# Altium project micromouse.PrjPcb
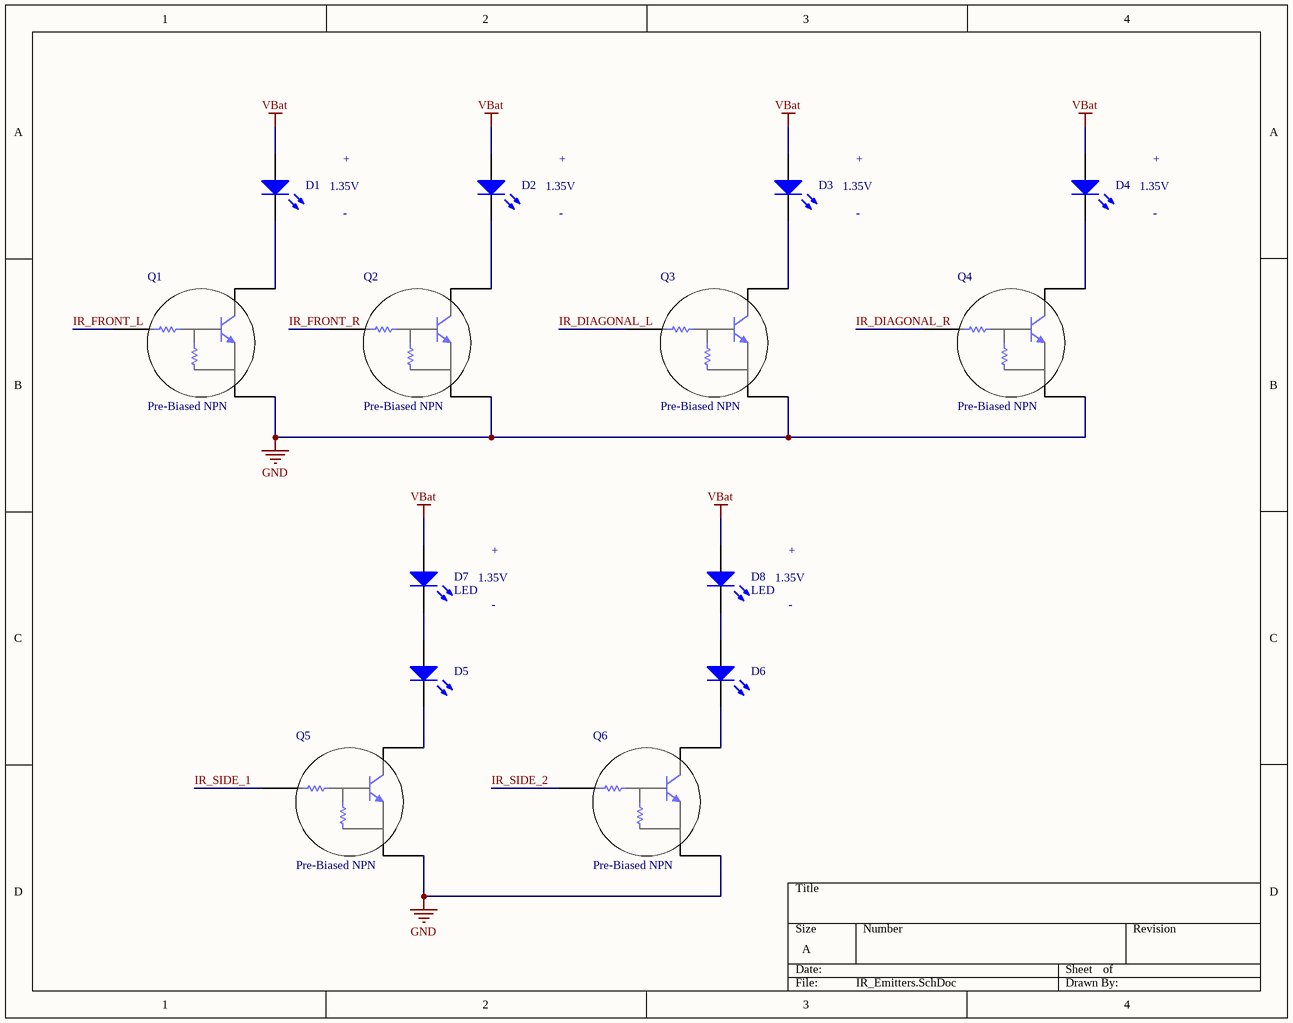
[diagram p0: IR_Emitters.SchDoc]
10 sheets, 109 parts. Net scope: global (net labels, ports and power ports of the same name join across sheets).
Board file: micromouse.PcbDoc
Sheets:
  IR_Emitters.SchDoc
  Gyroscope-Acceleromter.SchDoc
  Motor Control.SchDoc
  IR_Receivers.SchDoc
  Bluetooth.SchDoc
  Status_LED.SchDoc
  battery_charger.SchDoc
  Power_Regulation.SchDoc
  controller_power.SchDoc
  controller_peripherals.SchDoc

## Sheet IR_Emitters.SchDoc
size A

### Parts
D1  LED  [LED-Bent]  (value not drawn)
D2  LED  [LED-Bent]  (value not drawn)
D3  LED  [LED-Bent]  (value not drawn)
D4  LED  [LED-Bent]  (value not drawn)
D5  LED  [LED-Bent]  (value not drawn)
D6  LED  [LED-Bent]  (value not drawn)
D7  LED  [LED-Bent]
D8  LED  [LED-Bent]
Q1  Pre-Biased NPN  [SOT-416]
Q2  Pre-Biased NPN  [SOT-416]
Q3  Pre-Biased NPN  [SOT-416]
Q4  Pre-Biased NPN  [SOT-416]
Q5  Pre-Biased NPN  [SOT-416]
Q6  Pre-Biased NPN  [SOT-416]

### Nets
GND: Q1.2 Q2.2 Q3.2 Q4.2 Q5.2 Q6.2
VBat: D1.1(A) D2.1(A) D3.1(A) D4.1(A) D7.1(A) D8.1(A)
IR_DIAGONAL_L: Q3.1
IR_DIAGONAL_R: Q4.1
IR_FRONT_L: Q1.1
IR_FRONT_R: Q2.1
IR_SIDE_1: Q5.1
IR_SIDE_2: Q6.1
NetD1_2: D1.2(K) Q1.3
NetD2_2: D2.2(K) Q2.3
NetD3_2: D3.2(K) Q3.3
NetD4_2: D4.2(K) Q4.3
NetD5_1: D5.1(A) D7.2(K)
NetD5_2: D5.2(K) Q5.3
NetD6_1: D6.1(A) D8.2(K)
NetD6_2: D6.2(K) Q6.3

### Notes on the sheet
- +
- 1.35V
- -

### Library data of the parts
D1-D8 = LED: Vendor Part Number: 751-1203-ND; Manufacturer: Vishay; Manufacturer Part Number: TSAL6100; Vendor: Digikey; Published: 16-Mar-2013; LatestRevisionDate: 16-Mar-2013; LatestRevisionNote: Created; PackageReference: LED; Publisher: Anthony Merlino; PackageDescription: 5mm LED; 2 Leads
Q1-Q6 = Pre-Biased NPN: Manufacturer Part No: DTD743EETL; Vendor Part No: DTD743EETLTR-ND; Vendor: Digikey

## Sheet Gyroscope-Acceleromter.SchDoc
size A
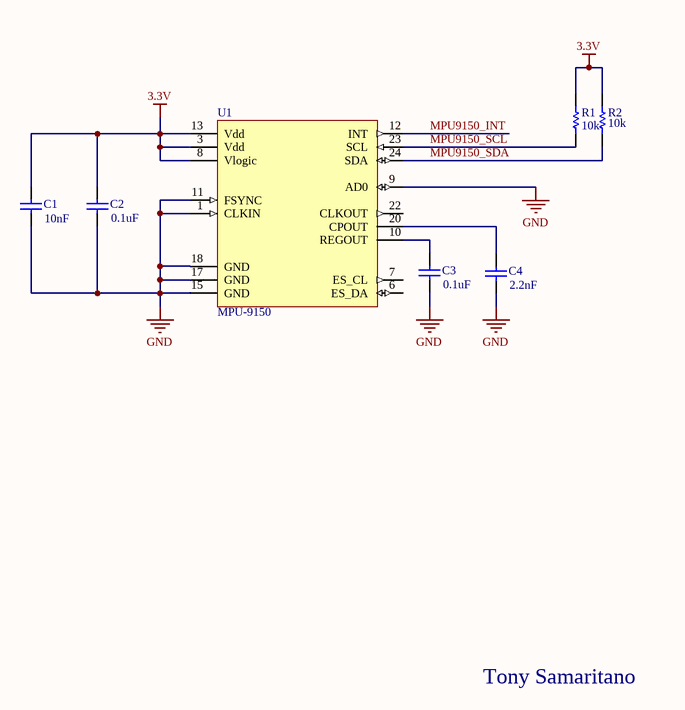
[diagram p1: Gyroscope-Acceleromter.SchDoc]

### Parts
C1  value 10nF  [1608[0603]]  (hidden comment: Cap Semi)
C2  value 0.1uF  [1608[0603]]  (hidden comment: Cap Semi)
C3  value 0.1uF  [1608[0603]]  (hidden comment: Cap Semi)
C4  value 2.2nF  [1608[0603]]  (hidden comment: Cap Semi)
R1  value 10k  [0603]  (hidden comment: Resistor)
R2  value 10k  [0603]  (hidden comment: Resistor)
U1  MPU-9150  [MPU-9150]

### Nets
3.3V: C1.2 C2.2 R1.2 R2.2 U1.3(Vdd) U1.8(Vlogic) U1.13(Vdd)
GND: C1.1 C2.1 C3.1 C4.1 U1.1(CLKIN) U1.9(AD0) U1.11(FSYNC) U1.15(GND) U1.17(GND) U1.18(GND)
MPU9150_INT: U1.12(INT)
MPU9150_SCL: R1.1 U1.23(SCL)
MPU9150_SDA: R2.1 U1.24(SDA)
NetC3_2: C3.2 U1.10(REGOUT)
NetC4_2: C4.2 U1.20(CPOUT)

Not connected (* = marked no-connect by the designer): U1 6(ES_DA) 7(ES_CL) 22(CLKOUT)

### Notes on the sheet
- Tony Samaritano

### Library data of the parts
C1-C4 = Cap Semi: Capacitor (Semiconductor SIM Model); Published: 8-Jun-2000; LatestRevisionDate: 29-May-2009; LatestRevisionNote: IPC-7351 Footprint Added.; PackageReference: C1206; Publisher: Altium Limited; PackageDescription: Chip Capacitor
R1 R2 = Resistor: Published: 8-Jun-2000; LatestRevisionDate: 17-Jul-2002; LatestRevisionNote: Re-released for DXP Platform.; PackageReference: AXIAL-0.3; Publisher: Altium Limited

## Sheet Motor Control.SchDoc
size A
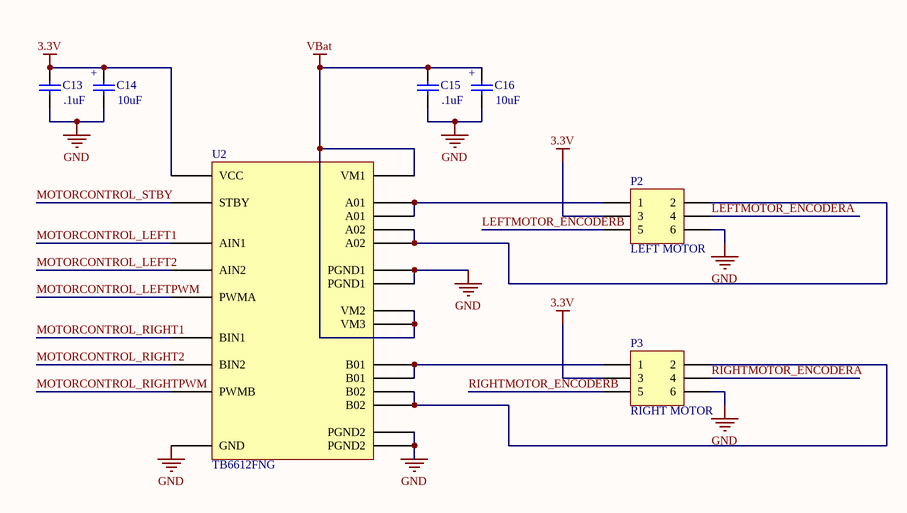
[diagram p2: Motor Control.SchDoc]

### Parts
C13  value .1uF  [1608[0603]]  (hidden comment: Cap Semi)
C14  value 10uF  [1608[0603]]  (hidden comment: Cap Semi)
C15  value .1uF  [1608[0603]]  (hidden comment: Cap Semi)
C16  value 10uF  [C1210]  (hidden comment: Cap Semi)
P2  LEFT MOTOR  [HDR2X3]
P3  RIGHT MOTOR  [HDR2X3]
U2  TB6612FNG  [SSOP24-P-300-0.65A]

### Nets
3.3V: C13.2 C14.2 P2.3 P3.3 U2.20(VCC)
GND: C13.1 C14.1 C15.1 C16.1 P2.6 P3.6 U2.3(PGND1) U2.4(PGND1) U2.9(PGND2) U2.10(PGND2) U2.18(GND)
VBat: C15.2 C16.2 U2.13(VM2) U2.14(VM3) U2.24(VM1)
LEFTMOTOR_ENCODERA: P2.4
LEFTMOTOR_ENCODERB: P2.5
MOTORCONTROL_LEFT1: U2.21(AIN1)
MOTORCONTROL_LEFT2: U2.22(AIN2)
MOTORCONTROL_LEFTPWM: U2.23(PWMA)
MOTORCONTROL_RIGHT1: U2.17(BIN1)
MOTORCONTROL_RIGHT2: U2.16(BIN2)
MOTORCONTROL_RIGHTPWM: U2.15(PWMB)
MOTORCONTROL_STBY: U2.19(STBY)
RIGHTMOTOR_ENCODERA: P3.4
RIGHTMOTOR_ENCODERB: P3.5
NetP2_1: P2.1 U2.1(A01) U2.2(A01)
NetP2_2: P2.2 U2.5(A02) U2.6(A02)
NetP3_1: P3.1 U2.11(B01) U2.12(B01)
NetP3_2: P3.2 U2.7(B02) U2.8(B02)

### Notes on the sheet
- (near C14) +
- (near C16) +

### Library data of the parts
C13-C16 = Cap Semi: Capacitor (Semiconductor SIM Model); Published: 8-Jun-2000; LatestRevisionDate: 29-May-2009; LatestRevisionNote: IPC-7351 Footprint Added.; PackageReference: C1206; Publisher: Altium Limited; PackageDescription: Chip Capacitor
P2 P3 = Header 3X2: Header, 3-Pin, Dual row; LatestRevisionDate: 17-Jul-2002; LatestRevisionNote: Re-released for DXP Platform.; Publisher: Altium Limited
U2 = TB6612FNG: Vendor Part No.: TB6612FNG(OC8EL)CT-ND; Manufacturer: Toshiba; Vendor: Digikey; Manufacturer Part No: TB6612FNG

## Sheet IR_Receivers.SchDoc
size A
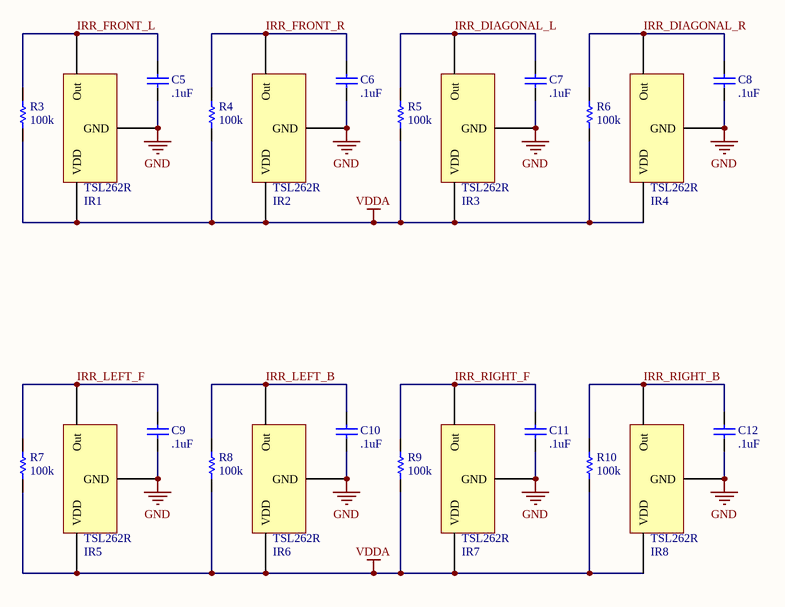
[diagram p3: IR_Receivers.SchDoc]

### Parts
C5  value .1uF  [1608[0603]]  (hidden comment: Cap Semi)
C6  value .1uF  [1608[0603]]  (hidden comment: Cap Semi)
C7  value .1uF  [1608[0603]]  (hidden comment: Cap Semi)
C8  value .1uF  [1608[0603]]  (hidden comment: Cap Semi)
C9  value .1uF  [1608[0603]]  (hidden comment: Cap Semi)
C10  value .1uF  [1608[0603]]  (hidden comment: Cap Semi)
C11  value .1uF  [1608[0603]]  (hidden comment: Cap Semi)
C12  value .1uF  [1608[0603]]  (hidden comment: Cap Semi)
IR1  TSL262R  [TSL262R]
IR2  TSL262R  [TSL262R]
IR3  TSL262R  [TSL262R]
IR4  TSL262R  [TSL262R]
IR5  TSL262R  [TSL262R]
IR6  TSL262R  [TSL262R]
IR7  TSL262R  [TSL262R]
IR8  TSL262R  [TSL262R]
R3  value 100k  [0603]  (hidden comment: Resistor)
R4  value 100k  [0603]  (hidden comment: Resistor)
R5  value 100k  [0603]  (hidden comment: Resistor)
R6  value 100k  [0603]  (hidden comment: Resistor)
R7  value 100k  [0603]  (hidden comment: Resistor)
R8  value 100k  [0603]  (hidden comment: Resistor)
R9  value 100k  [0603]  (hidden comment: Resistor)
R10  value 100k  [0603]  (hidden comment: Resistor)

### Nets
GND: C5.1 C6.1 C7.1 C8.1 C9.1 C10.1 C11.1 C12.1 IR1.0(GND) IR2.0(GND) IR3.0(GND) IR4.0(GND) IR5.0(GND) IR6.0(GND) IR7.0(GND) IR8.0(GND)
VDDA: IR1.1(VDD) IR2.1(VDD) IR3.1(VDD) IR4.1(VDD) IR5.1(VDD) IR6.1(VDD) IR7.1(VDD) IR8.1(VDD) R3.1 R4.1 R5.1 R6.1 R7.1 R8.1 R9.1 R10.1  [project net 3.3V]
IRR_DIAGONAL_L: C7.2 IR3.2(Out) R5.2
IRR_DIAGONAL_R: C8.2 IR4.2(Out) R6.2
IRR_FRONT_L: C5.2 IR1.2(Out) R3.2
IRR_FRONT_R: C6.2 IR2.2(Out) R4.2
IRR_LEFT_B: C10.2 IR6.2(Out) R8.2
IRR_LEFT_F: C9.2 IR5.2(Out) R7.2
IRR_RIGHT_B: C12.2 IR8.2(Out) R10.2
IRR_RIGHT_F: C11.2 IR7.2(Out) R9.2

### Library data of the parts
C5-C12 = Cap Semi: Capacitor (Semiconductor SIM Model); Published: 8-Jun-2000; LatestRevisionDate: 29-May-2009; LatestRevisionNote: IPC-7351 Footprint Added.; PackageReference: C1206; Publisher: Altium Limited; PackageDescription: Chip Capacitor
R3-R10 = Resistor: Published: 8-Jun-2000; LatestRevisionDate: 17-Jul-2002; LatestRevisionNote: Re-released for DXP Platform.; PackageReference: AXIAL-0.3; Publisher: Altium Limited

## Sheet Bluetooth.SchDoc
size A
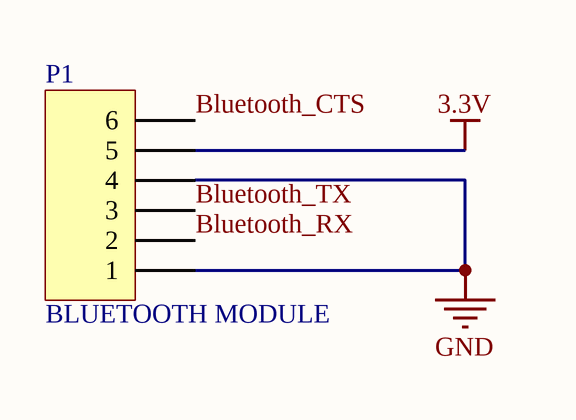
[diagram p4: Bluetooth.SchDoc]

### Parts
P1  BLUETOOTH MODULE  [HDR1X6]

### Nets
3.3V: P1.5
GND: P1.1 P1.4
Bluetooth_CTS: P1.6
Bluetooth_RX: P1.2
Bluetooth_TX: P1.3

### Library data of the parts
P1 = Header 6: Header, 6-Pin; LatestRevisionDate: 17-Jul-2002; LatestRevisionNote: Re-released for DXP Platform.; Publisher: Altium Limited

## Sheet Status_LED.SchDoc
size A
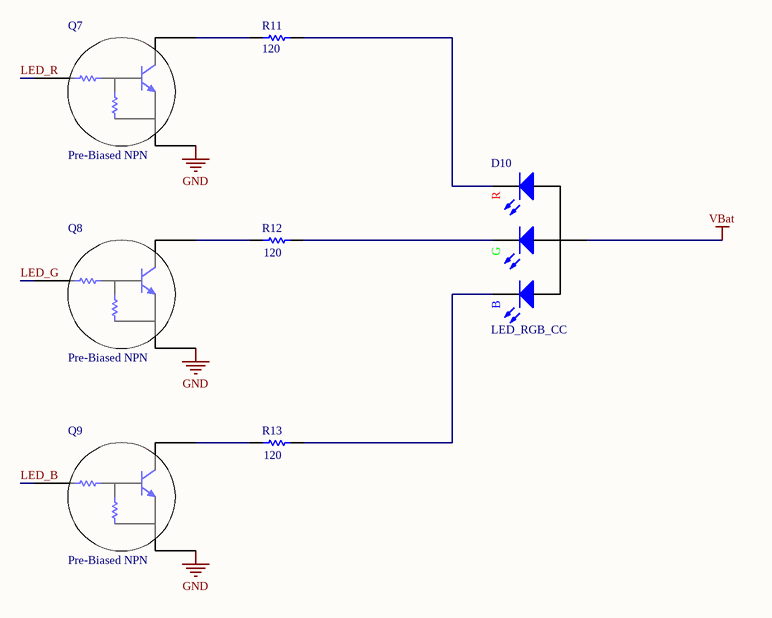
[diagram p5: Status_LED.SchDoc]

### Parts
D10  LED_RGB_CC  [SM1210RGB]
Q7  Pre-Biased NPN  [SOT-416]
Q8  Pre-Biased NPN  [SOT-416]
Q9  Pre-Biased NPN  [SOT-416]
R11  value 120  [0603]  (hidden comment: Resistor)
R12  value 120  [0603]  (hidden comment: Resistor)
R13  value 120  [0603]  (hidden comment: Resistor)

### Nets
GND: Q7.2 Q8.2 Q9.2
VBat: D10.1
LED_B: Q9.1
LED_G: Q8.1
LED_R: Q7.1
NetD10_2: D10.2 R11.2
NetD10_3: D10.3 R12.2
NetD10_4: D10.4 R13.2
NetQ7_3: Q7.3 R11.1
NetQ8_3: Q8.3 R12.1
NetQ9_3: Q9.3 R13.1

### Notes on the sheet
- (in symbol LED_RGB_CC) R; G; B

### Library data of the parts
D10 = LED_RGB_CC: RGB LED Common Cathode
Q7-Q9 = Pre-Biased NPN: as Q1 on sheet IR_Emitters
R11-R13 = Resistor: Published: 8-Jun-2000; LatestRevisionDate: 17-Jul-2002; LatestRevisionNote: Re-released for DXP Platform.; PackageReference: AXIAL-0.3; Publisher: Altium Limited

## Sheet battery_charger.SchDoc
size A
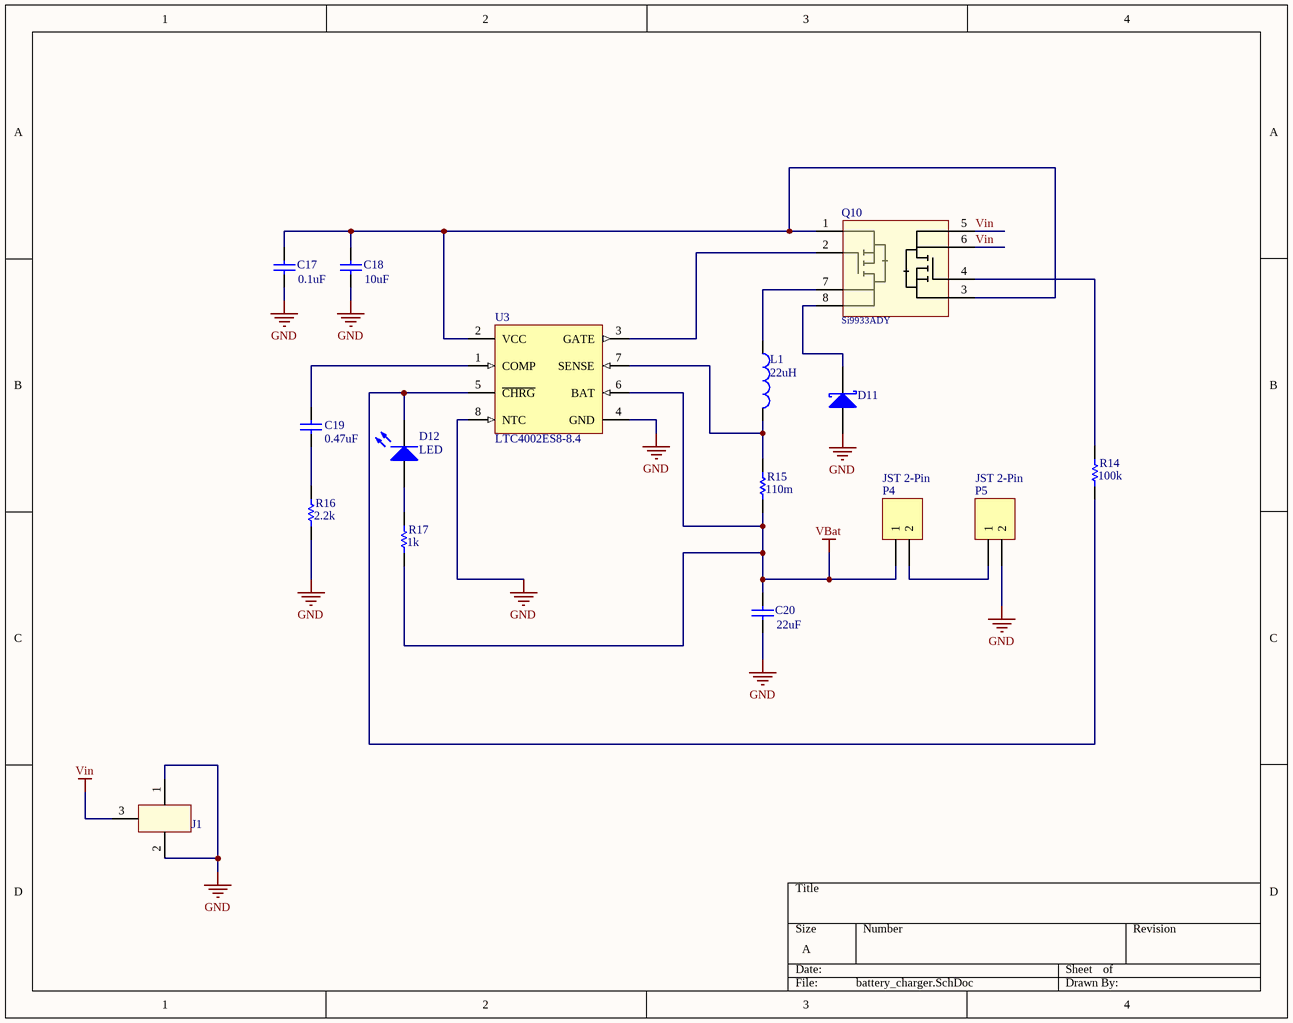
[diagram p6: battery_charger.SchDoc]

### Parts
C17  value 0.1uF  [1608[0603]]  (hidden comment: Cap Semi)
C18  value 10uF  [C1210]  (hidden comment: Cap Semi)
C19  value 0.47uF  [1608[0603]]  (hidden comment: Cap Semi)
C20  value 22uF  [C1210]  (hidden comment: Cap Semi)
D11  D Schottky  [SMB]  (value not drawn)
D12  LED  [0603]
J1  DC Barrel Jack  [DC Barrel Jack]  (value not drawn)
L1  value 22uH  [INDC6060X49N]  (hidden comment: Inductor)
P4  JST 2-Pin  [JST Connector 2-pin]
P5  JST 2-Pin  [JST Connector 2-pin]
Q10  Dual P-Channel  [SOIC-8]  (value not drawn)
R14  value 100k  [0603]  (hidden comment: Resistor)
R15  value 110m  [0603]  (hidden comment: Resistor)
R16  value 2.2k  [0603]  (hidden comment: Resistor)
R17  value 1k  [0603]  (hidden comment: Resistor)
U3  LTC4002ES8-8.4  [LT-S8-8_N]

### Nets
GND: C17.1 C18.1 C20.1 D11.1(A) J1.1(Casing) J1.2(Casing) P5.2 R16.1 U3.4(GND) U3.8(NTC)
VBat: C20.2 P4.1 R15.1 R17.1 U3.6(BAT)
Vin: J1.3(Center) Q10.5(D2) Q10.6(D2)
NetC17_2: C17.2 C18.2 Q10.1(S1) Q10.3(S2) U3.2(VCC)
NetC19_1: C19.1 R16.2
NetC19_2: C19.2 U3.1(COMP)
NetD11_2: D11.2(K) Q10.8(D1)
NetD12_1: D12.1(A) R17.2
NetD12_2: D12.2(K) R14.1 U3.5(~{CHRG})
NetL1_1: L1.1 Q10.7(D1)
NetL1_2: L1.2 R15.2 U3.7(SENSE)
NetP4_2: P4.2 P5.1
NetQ10_2: Q10.2(G1) U3.3(GATE)
NetQ10_4: Q10.4(G2) R14.2

### Library data of the parts
C17-C20 = Cap Semi: Capacitor (Semiconductor SIM Model); Published: 8-Jun-2000; LatestRevisionDate: 29-May-2009; LatestRevisionNote: IPC-7351 Footprint Added.; PackageReference: C1206; Publisher: Altium Limited; PackageDescription: Chip Capacitor
D11 = D Schottky: Schottky Diode; Published: 8-Jun-2000; LatestRevisionDate: 17-Jul-2002; LatestRevisionNote: Re-released for DXP Platform.; PackageReference: SMB; Publisher: Altium Limited; PackageDescription: DO-214-AA/SMB; 2 C-Bend Leads; Body 5.3 x 3.6 mm, inc. leads (LxW); Code_JEDEC: DO-214-AA
D12 = LED: as D1 on sheet IR_Emitters; Published: 16-Mar-2013; LatestRevisionDate: 16-Mar-2013; LatestRevisionNote: Created; PackageReference: LED; Publisher: Anthony Merlino; PackageDescription: 5mm LED; 2 Leads
J1 = DC Barrel Jack: DC Barrel Jack, Fits 5mm DC Wall Adapter
L1 = Inductor: Code_IEC: 1005; Published: 8-Jun-2000; LatestRevisionDate: 29-May-2009; LatestRevisionNote: IPC-7351 Footprint Added.; PackageReference: 0402-A; Publisher: Altium Limited; PackageDescription: Chip Inductor; Code_JEITA: 0402
P4 P5 = JST Connector 2-Pin: Header, 2-Pin; LatestRevisionDate: 17-Jul-2002; LatestRevisionNote: Re-released for DXP Platform.; Publisher: Altium Limited
Q10 = Si9933ADY: Dual P-Channel 20-V (D-S) MOSFET; Manufacturer Part N.O.: Si9933ADY
U3 = LTC4002ES8-8.4: Standalone Li-Ion Switch Mode Battery Charger, 8.9 to 22 V Vin, 8-pin SOIC (S8-8), -40 to 85 degC; Manufacturer: Linear Technology; Battery Chemistry: Li-Ion, Li-Polymer; Charge Termination: On-board timer; Float Voltage: 8.4 V; Number of Cells: 2; Type of Charger: Switching; Vin Max(V): 22; Vin Min(V): 8.9; PackageVersion: Rev. G, 03/2012; PackageReference: S8-8; PackageDescription: 8-Pin Plastic Small Outline (Narrow .150 Inch), Body 4.9 x 3.9 mm, Pitch 1.27 mm; Supplier 1: Digi-Key; Supplier Part Number 1: LTC4002ES8-8.4-ND; RoHS: FALSE; Mounting Technology: Surface Mount; PartNumber: LTC4002ES8-8.4; ComponentLink1Description: Manufacturer URL; ComponentLink1URL: http://www.linear.com/; ComponentLink2Description: Datasheet; ComponentLink2URL: http://cds.linear.com/docs/en/datasheet/4002f.pdf; ComponentLink3Description: Package Specification; ComponentLink3URL: http://cds.linear.com/docs/en/packaging/05081610_G_SO8.pdf
R14-R17 = Resistor: Published: 8-Jun-2000; LatestRevisionDate: 17-Jul-2002; LatestRevisionNote: Re-released for DXP Platform.; PackageReference: AXIAL-0.3; Publisher: Altium Limited

## Sheet Power_Regulation.SchDoc
size A
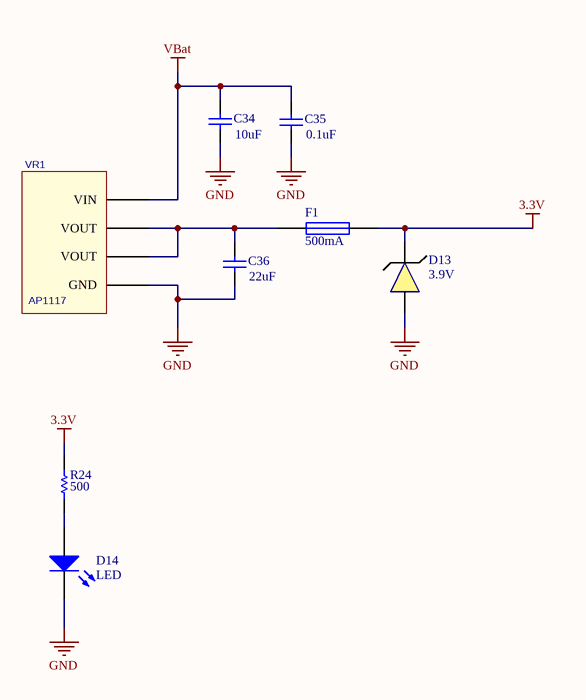
[diagram p7: Power_Regulation.SchDoc]

### Parts
C34  value 10uF  [1608[0603]]  (hidden comment: Cap Semi)
C35  value 0.1uF  [1608[0603]]  (hidden comment: Cap Semi)
C36  value 22uF  [1608[0603]]  (hidden comment: Cap Semi)
D13  3.9V  [DO-214AC]
D14  LED  [0603]
F1  500mA  [0603 PTC Fuse]
R24  value 500  [0603]  (hidden comment: Resistor)
VR1  AP1117  [SOT-223]

### Nets
3.3V: D13.1 F1.2 R24.2
GND: C34.1 C35.1 C36.1 D13.2 D14.2(K) VR1.1(GND)
VBat: C34.2 C35.2 VR1.3(VIN)
NetC36_2: C36.2 F1.1 VR1.2(VOUT) VR1.4(VOUT)
NetD14_1: D14.1(A) R24.1

### Library data of the parts
C34-C36 = Cap Semi: Capacitor (Semiconductor SIM Model); Published: 8-Jun-2000; LatestRevisionDate: 29-May-2009; LatestRevisionNote: IPC-7351 Footprint Added.; PackageReference: C1206; Publisher: Altium Limited; PackageDescription: Chip Capacitor
D13 = Zener Diode: 3.9V 1.25W
D14 = LED: as D1 on sheet IR_Emitters; Published: 16-Mar-2013; LatestRevisionDate: 16-Mar-2013; LatestRevisionNote: Created; PackageReference: LED; Publisher: Anthony Merlino; PackageDescription: 5mm LED; 2 Leads
F1 = Fuse: Published: 8-Jun-2000; LatestRevisionDate: 17-Jul-2002; LatestRevisionNote: Re-released for DXP Platform.; PackageReference: PIN-W2/E2.8; Publisher: Altium Limited; PackageDescription: Thru-Hole; 2 Leads
R24 = Resistor: Published: 8-Jun-2000; LatestRevisionDate: 17-Jul-2002; LatestRevisionNote: Re-released for DXP Platform.; PackageReference: AXIAL-0.3; Publisher: Altium Limited
VR1 = AP1117: Value: *

## Sheet controller_power.SchDoc
size A
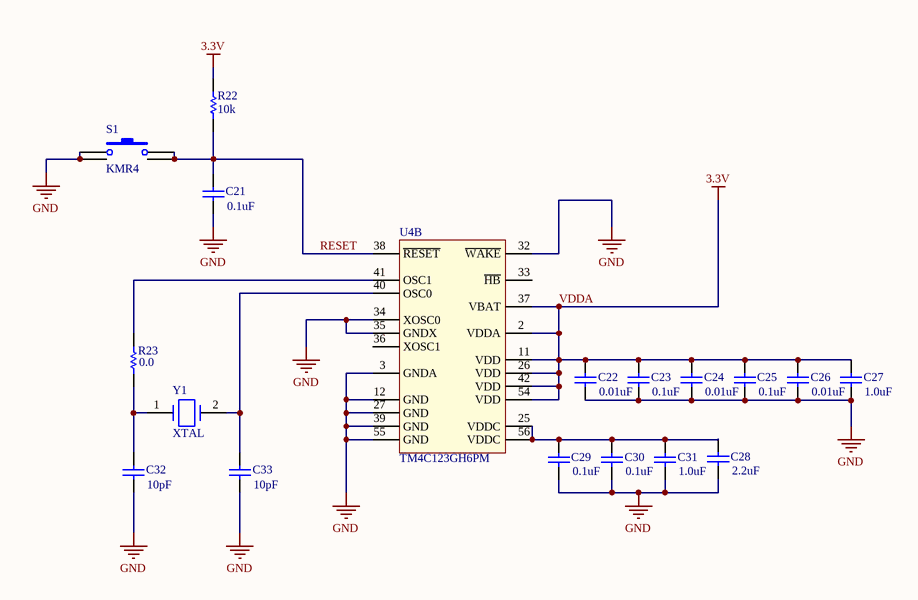
[diagram p8: controller_power.SchDoc]

### Parts
C21  value 0.1uF  [1608[0603]]  (hidden comment: Cap Semi)
C22  value 0.01uF  [1608[0603]]  (hidden comment: Cap Semi)
C23  value 0.1uF  [1608[0603]]  (hidden comment: Cap Semi)
C24  value 0.01uF  [1608[0603]]  (hidden comment: Cap Semi)
C25  value 0.1uF  [1608[0603]]  (hidden comment: Cap Semi)
C26  value 0.01uF  [1608[0603]]  (hidden comment: Cap Semi)
C27  value 1.0uF  [1608[0603]]  (hidden comment: Cap Semi)
C28  value 2.2uF  [1608[0603]]  (hidden comment: Cap Semi)
C29  value 0.1uF  [1608[0603]]  (hidden comment: Cap Semi)
C30  value 0.1uF  [1608[0603]]  (hidden comment: Cap Semi)
C31  value 1.0uF  [1608[0603]]  (hidden comment: Cap Semi)
C32  value 10pF  [1608[0603]]  (hidden comment: Cap Semi)
C33  value 10pF  [1608[0603]]  (hidden comment: Cap Semi)
R22  value 10k  [0603]  (hidden comment: Resistor)
R23  value 0.0  [0603]  (hidden comment: Resistor)
S1  KMR4  [KMR4]
U4  TM4C123GH6PM  [TSQFP50P1200X1200X145-64N]  (part B of 2)
Y1  XTAL  [ABM3_SERIES]

### Nets
3.3V: C22.2 C23.2 C24.2 C25.2 C26.2 C27.2 R22.2 U4.2(VDDA) U4.11(VDD) U4.26(VDD) U4.37(VBAT) U4.42(VDD) U4.54(VDD)  [also labelled VDDA]
GND: C21.1 C22.1 C23.1 C24.1 C25.1 C26.1 C27.1 C28.1 C29.1 C30.1 C31.1 C32.1 C33.1 S1.1 S1.3 U4.3(GNDA) U4.12(GND) U4.27(GND) U4.32(~{WAKE}) U4.34(XOSC0) U4.35(GNDX) U4.39(GND) U4.55(GND)
RESET: C21.2 R22.1 S1.2 S1.4 U4.38(~{RESET})
NetC28_2: C28.2 C29.2 C30.2 C31.2 U4.25(VDDC) U4.56(VDDC)
NetC32_2: C32.2 R23.1 Y1.1(OSC1)
NetC33_2: C33.2 U4.40(OSC0) Y1.2(OSC2)
NetR23_2: R23.2 U4.41(OSC1)

Not connected (* = marked no-connect by the designer): U4 33(~{HB}) 36(XOSC1)

### Library data of the parts
C21-C33 = Cap Semi: Capacitor (Semiconductor SIM Model); Published: 8-Jun-2000; LatestRevisionDate: 29-May-2009; LatestRevisionNote: IPC-7351 Footprint Added.; PackageReference: C1206; Publisher: Altium Limited; PackageDescription: Chip Capacitor
S1 = SPST Tactile Switch: Switch; Published: 24-Mar-1999; LatestRevisionDate: 17-Jul-2002; LatestRevisionNote: Re-released for DXP Platform.; PackageReference: SPST-2; Publisher: Altium Limited
U4 = TM4C123GH6PM: Tiva C TM4C123GH6PM
Y1 = XTAL: Crystal Oscillator; Published: 8-Jun-2000; LatestRevisionDate: 17-Jul-2002; LatestRevisionNote: Re-released for DXP Platform.; PackageReference: R38; Publisher: Altium Limited; PackageDescription: Crystal, Thru-Hole; 2 Leads; Body 3.1 x 8.2 mm (Dia.xH)
R22 R23 = Resistor: Published: 8-Jun-2000; LatestRevisionDate: 17-Jul-2002; LatestRevisionNote: Re-released for DXP Platform.; PackageReference: AXIAL-0.3; Publisher: Altium Limited

## Sheet controller_peripherals.SchDoc
size A
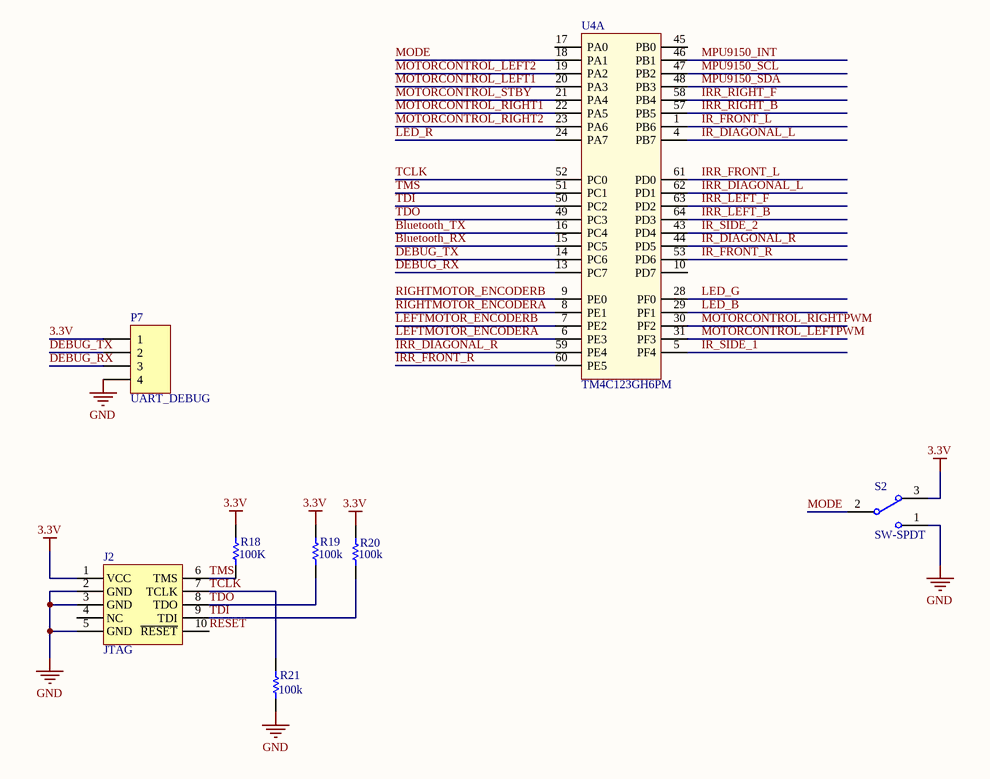
[diagram p9: controller_peripherals.SchDoc]

### Parts
J2  JTAG  [HDR2X5]
P7  UART_DEBUG  [HDR1X4]
R18  value 100K  [0603]  (hidden comment: Resistor)
R19  value 100k  [0603]  (hidden comment: Resistor)
R20  value 100k  [0603]  (hidden comment: Resistor)
R21  value 100k  [0603]  (hidden comment: Resistor)
S2  SW-SPDT  [SPDT Switch]
U4  TM4C123GH6PM  [TSQFP50P1200X1200X145-64N]  (part A of 2)

### Nets
3.3V: J2.1(VCC) P7.1 R18.2 R19.2 R20.2 S2.3
GND: J2.2(GND) J2.3(GND) J2.5(GND) P7.4 R21.1 S2.1
Bluetooth_RX: U4.15(PC5)
Bluetooth_TX: U4.16(PC4)
DEBUG_RX: P7.3 U4.13(PC7)
DEBUG_TX: P7.2 U4.14(PC6)
IR_DIAGONAL_L: U4.4(PB7)
IR_DIAGONAL_R: U4.44(PD5)
IR_FRONT_L: U4.1(PB6)
IR_FRONT_R: U4.53(PD6)
IR_SIDE_1: U4.5(PF4)
IR_SIDE_2: U4.43(PD4)
IRR_DIAGONAL_L: U4.62(PD1)
IRR_DIAGONAL_R: U4.59(PE4)
IRR_FRONT_L: U4.61(PD0)
IRR_FRONT_R: U4.60(PE5)
IRR_LEFT_B: U4.64(PD3)
IRR_LEFT_F: U4.63(PD2)
IRR_RIGHT_B: U4.57(PB5)
IRR_RIGHT_F: U4.58(PB4)
LED_B: U4.29(PF1)
LED_G: U4.28(PF0)
LED_R: U4.24(PA7)
LEFTMOTOR_ENCODERA: U4.6(PE3)
LEFTMOTOR_ENCODERB: U4.7(PE2)
MODE: S2.2 U4.18(PA1)
MOTORCONTROL_LEFT1: U4.20(PA3)
MOTORCONTROL_LEFT2: U4.19(PA2)
MOTORCONTROL_LEFTPWM: U4.31(PF3)
MOTORCONTROL_RIGHT1: U4.22(PA5)
MOTORCONTROL_RIGHT2: U4.23(PA6)
MOTORCONTROL_RIGHTPWM: U4.30(PF2)
MOTORCONTROL_STBY: U4.21(PA4)
MPU9150_INT: U4.46(PB1)
MPU9150_SCL: U4.47(PB2)
MPU9150_SDA: U4.48(PB3)
RESET: J2.10(~{RESET})
RIGHTMOTOR_ENCODERA: U4.8(PE1)
RIGHTMOTOR_ENCODERB: U4.9(PE0)
TCLK: J2.7(TCLK) R21.2 U4.52(PC0)
TDI: J2.9(TDI) R20.1 U4.50(PC2)
TDO: J2.8(TDO) R19.1 U4.49(PC3)
TMS: J2.6(TMS) R18.1 U4.51(PC1)

Not connected (* = marked no-connect by the designer): J2 4(NC); U4 10(PD7) 17(PA0) 45(PB0)

### Library data of the parts
J2 = 10-Pin JTAG ARM: 10-Pin JTAG Connector for Cortex M4 etc.
P7 = Header 4: Header, 4-Pin; LatestRevisionDate: 17-Jul-2002; LatestRevisionNote: Re-released for DXP Platform.; Publisher: Altium Limited
S2 = SW-SPDT: SPDT Subminiature Toggle Switch, Right Angle Mounting, Vertical Actuation; Published: 24-Mar-1999; LatestRevisionDate: 17-Dec-2003; LatestRevisionNote: Schematic revised, PCB Footprint replaced.; DatasheetVersion: 05-Dec-2000; PackageReference: TL36WW15050; Publisher: Altium Limited; PackageDescription: Switch; 4 Leads; ComponentLink1Description: Manufacturer Link; ComponentLink1URL: http://www.apem.com
U4 = TM4C123GH6PM: Tiva C TM4C123GH6PM
R18-R21 = Resistor: Published: 8-Jun-2000; LatestRevisionDate: 17-Jul-2002; LatestRevisionNote: Re-released for DXP Platform.; PackageReference: AXIAL-0.3; Publisher: Altium Limited

## Nets that join several sheets
3.3V: Gyroscope-Acceleromter (7 pins), Motor Control (5 pins), IR_Receivers (16 pins), Bluetooth (P1.5), Power_Regulation (D13.1 F1.2 R24.2), controller_power (13 pins), controller_peripherals (6 pins)
GND: IR_Emitters (6 pins), Gyroscope-Acceleromter (10 pins), Motor Control (11 pins), IR_Receivers (16 pins), Bluetooth (P1.1 P1.4), Status_LED (Q7.2 Q8.2 Q9.2), battery_charger (10 pins), Power_Regulation (6 pins), controller_power (23 pins), controller_peripherals (6 pins)
VBat: IR_Emitters (6 pins), Motor Control (5 pins), Status_LED (D10.1), battery_charger (5 pins), Power_Regulation (C34.2 C35.2 VR1.3)
Bluetooth_RX: Bluetooth (P1.2), controller_peripherals (U4.15)
Bluetooth_TX: Bluetooth (P1.3), controller_peripherals (U4.16)
IR_DIAGONAL_L: IR_Emitters (Q3.1), controller_peripherals (U4.4)
IR_DIAGONAL_R: IR_Emitters (Q4.1), controller_peripherals (U4.44)
IR_FRONT_L: IR_Emitters (Q1.1), controller_peripherals (U4.1)
IR_FRONT_R: IR_Emitters (Q2.1), controller_peripherals (U4.53)
IR_SIDE_1: IR_Emitters (Q5.1), controller_peripherals (U4.5)
IR_SIDE_2: IR_Emitters (Q6.1), controller_peripherals (U4.43)
IRR_DIAGONAL_L: IR_Receivers (C7.2 IR3.2 R5.2), controller_peripherals (U4.62)
IRR_DIAGONAL_R: IR_Receivers (C8.2 IR4.2 R6.2), controller_peripherals (U4.59)
IRR_FRONT_L: IR_Receivers (C5.2 IR1.2 R3.2), controller_peripherals (U4.61)
IRR_FRONT_R: IR_Receivers (C6.2 IR2.2 R4.2), controller_peripherals (U4.60)
IRR_LEFT_B: IR_Receivers (C10.2 IR6.2 R8.2), controller_peripherals (U4.64)
IRR_LEFT_F: IR_Receivers (C9.2 IR5.2 R7.2), controller_peripherals (U4.63)
IRR_RIGHT_B: IR_Receivers (C12.2 IR8.2 R10.2), controller_peripherals (U4.57)
IRR_RIGHT_F: IR_Receivers (C11.2 IR7.2 R9.2), controller_peripherals (U4.58)
LED_B: Status_LED (Q9.1), controller_peripherals (U4.29)
LED_G: Status_LED (Q8.1), controller_peripherals (U4.28)
LED_R: Status_LED (Q7.1), controller_peripherals (U4.24)
LEFTMOTOR_ENCODERA: Motor Control (P2.4), controller_peripherals (U4.6)
LEFTMOTOR_ENCODERB: Motor Control (P2.5), controller_peripherals (U4.7)
MOTORCONTROL_LEFT1: Motor Control (U2.21), controller_peripherals (U4.20)
MOTORCONTROL_LEFT2: Motor Control (U2.22), controller_peripherals (U4.19)
MOTORCONTROL_LEFTPWM: Motor Control (U2.23), controller_peripherals (U4.31)
MOTORCONTROL_RIGHT1: Motor Control (U2.17), controller_peripherals (U4.22)
MOTORCONTROL_RIGHT2: Motor Control (U2.16), controller_peripherals (U4.23)
MOTORCONTROL_RIGHTPWM: Motor Control (U2.15), controller_peripherals (U4.30)
MOTORCONTROL_STBY: Motor Control (U2.19), controller_peripherals (U4.21)
MPU9150_INT: Gyroscope-Acceleromter (U1.12), controller_peripherals (U4.46)
MPU9150_SCL: Gyroscope-Acceleromter (R1.1 U1.23), controller_peripherals (U4.47)
MPU9150_SDA: Gyroscope-Acceleromter (R2.1 U1.24), controller_peripherals (U4.48)
RESET: controller_power (5 pins), controller_peripherals (J2.10)
RIGHTMOTOR_ENCODERA: Motor Control (P3.4), controller_peripherals (U4.8)
RIGHTMOTOR_ENCODERB: Motor Control (P3.5), controller_peripherals (U4.9)